# EAGLE design PRE_amp_16_5 (EAGLE 5.06)
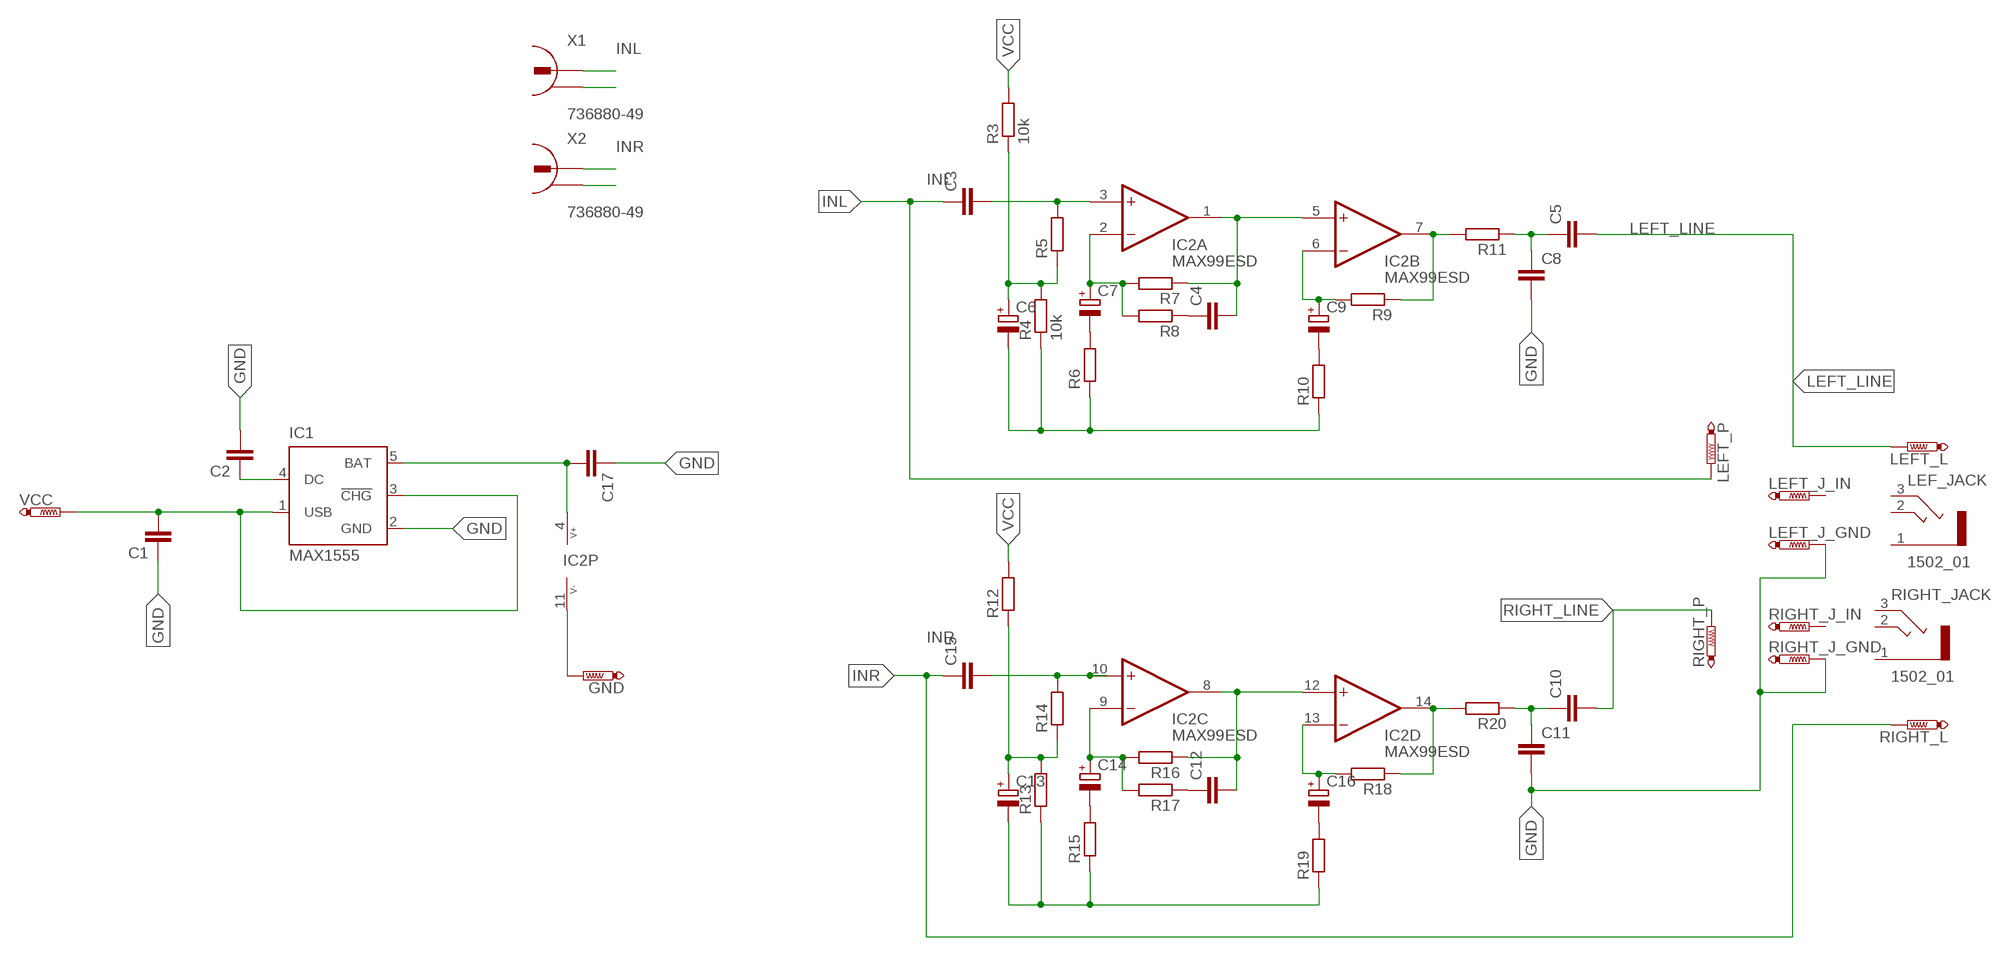
[diagram p0: schematic, sheet 1]

## Parts
C1  C-EU050-025X075  [C050-025X075]
C2  C-EU050-025X075  [C050-025X075]
C3  C-EU050-025X075  [C050-025X075]
C4  C-EU050-025X075  [C050-025X075]
C5  C-EU050-025X075  [C050-025X075]
C6  CPOL-EUB45181B  [B45181B]
C7  CPOL-EUB45181B  [B45181B]
C8  C-EU050-025X075  [C050-025X075]
C9  CPOL-EUB45181B  [B45181B]
C10  C-EU050-025X075  [C050-025X075]
C11  C-EU050-025X075  [C050-025X075]
C12  C-EU050-025X075  [C050-025X075]
C13  CPOL-EUB45181B  [B45181B]
C14  CPOL-EUB45181B  [B45181B]
C15  C-EU050-025X075  [C050-025X075]
C16  CPOL-EUB45181B  [B45181B]
C17  C-EU050-025X075  [C050-025X075]
GND  PTR1PAD1-13Y  [P1-13Y]
IC1  MAX1555  [SOT23-5L]
IC2  MAX99ESD  [SO14]
LEF_JACK  1502_01  [1502_01]
LEFT_J_GND  PTR1PAD1-13Y  [P1-13Y]
LEFT_J_IN  PTR1PAD1-13Y  [P1-13Y]
LEFT_L  PTR1PAD1-13Y  [P1-13Y]
LEFT_P  PTR1PAD1-13Y  [P1-13Y]
R3  10k  R-EU_R5025  [R5025]
R4  10k  R-EU_R5025  [R5025]
R5  R-EU_R5025  [R5025]
R6  R-EU_R5025  [R5025]
R7  R-EU_R5025  [R5025]
R8  R-EU_R5025  [R5025]
R9  R-EU_R5025  [R5025]
R10  R-EU_R5025  [R5025]
R11  R-EU_R5025  [R5025]
R12  R-EU_R5025  [R5025]
R13  R-EU_R5025  [R5025]
R14  R-EU_R5025  [R5025]
R15  R-EU_R5025  [R5025]
R16  R-EU_R5025  [R5025]
R17  R-EU_R5025  [R5025]
R18  R-EU_R5025  [R5025]
R19  R-EU_R5025  [R5025]
R20  R-EU_R5025  [R5025]
RIGHT_J_GND  PTR1PAD1-13Y  [P1-13Y]
RIGHT_J_IN  PTR1PAD1-13Y  [P1-13Y]
RIGHT_JACK  1502_01  [1502_01]
RIGHT_L  PTR1PAD1-13Y  [P1-13Y]
RIGHT_P  PTR1PAD1-13Y  [P1-13Y]
VCC  PTR1PAD1-13Y  [P1-13Y]
X1  736880-49  [736880-49]
X2  736880-49  [736880-49]

## Nets
GND: C1.1 C2.2 C6.- C8.2 C11.2 C13.- C17.1 GND.1(TP) IC1.2(GND) IC2.11(P:V-) LEFT_J_GND.1(TP) R4.1 R6.1 R10.1 R13.1 R15.1 R19.1 RIGHT_J_GND.1(TP) X1.2 X2.2
INL: C3.1 LEFT_P.1(TP) X1.1
INR: C15.1 RIGHT_L.1(TP) X2.1
LEFT_LINE: C5.2 LEFT_L.1(TP)
N$1: C3.2 IC2.3(A:+IN) R5.2
N$2: C6.+ R3.1 R4.2 R5.1
N$3: C15.2 IC2.10(C:+IN) R14.2
N$4: C13.+ R12.1 R13.2 R14.1
N$5: IC2.7(B:OUT) R9.1 R11.2
N$6: C7.- R6.2
N$7: C4.1 R8.1
N$8: C12.1 R17.1
N$9: C7.+ IC2.2(A:-IN) R7.2 R8.2
N$10: C9.- R10.2
N$11: C5.1 C8.1 R11.1
N$12: C14.- R15.2
N$13: C9.+ IC2.6(B:-IN) R9.2
N$14: C1.2 IC1.1(USB) IC1.3(!CHG) VCC.1(TP)
N$15: C12.2 IC2.8(C:OUT) IC2.12(D:+IN) R16.1
N$16: C14.+ IC2.9(C:-IN) R16.2 R17.2
N$17: C16.- R19.2
N$18: IC2.14(D:OUT) R18.1 R20.2
N$19: C4.2 IC2.1(A:OUT) IC2.5(B:+IN) R7.1
N$20: C16.+ IC2.13(D:-IN) R18.2
N$21: C17.2 IC1.5(BAT) IC2.4(P:V+)
N$22: C2.1 IC1.4(DC)
NS2: C10.1 C11.1 R20.1
RIGHT_LINE: C10.2 RIGHT_P.1(TP)
VCC: R3.2 R12.2
Unconnected: LEF_JACK.1 LEF_JACK.2 LEF_JACK.3 LEFT_J_IN.1(TP) RIGHT_J_IN.1(TP) RIGHT_JACK.1 RIGHT_JACK.2 RIGHT_JACK.3 X1.2@2 X2.2@2

## Library data of the parts
C1-C5 C8 C10-C12 C15 C17 = rcl:C-EU: CAPACITOR, European symbol
C6 C7 C9 C13 C14 C16 = rcl:CPOL-EU: POLARIZED CAPACITOR, European symbol
GND LEFT_J_GND LEFT_J_IN LEFT_L LEFT_P RIGHT_J_GND RIGHT_J_IN RIGHT_L RIGHT_P VCC = testpad:PTR1: TEST PIN
IC1 = maxim:MAX1555: Dual-Input USB/AC Adapter 1-Cell Li+ Battery Chargers Source: http://www.maxim-ic.com .. MAX1551-MAX1555.pdf
IC2 = maxim:MAX99*: Micropower, Low-Voltage Rail-to-Rail I/O Comparators Source: http://pdfserv.maxim-ic.com/en/ds/MAX985-MAX994.pdf
LEF_JACK RIGHT_JACK = con-lumberg:1502_01: Jack connectors according to JISC 6560, 3.5 mm Klinkensteckverbinder nach JISC 6560, 3,5 mm Source: http://www.lumberg.com/Produkte/PDFs/1502_01.pdf
R3-R20 = rcl:R-EU_: RESISTOR, European symbol
X1 X2 = con-conrad:736880-49: Cinch Connector ( RCA Jack )

## Board
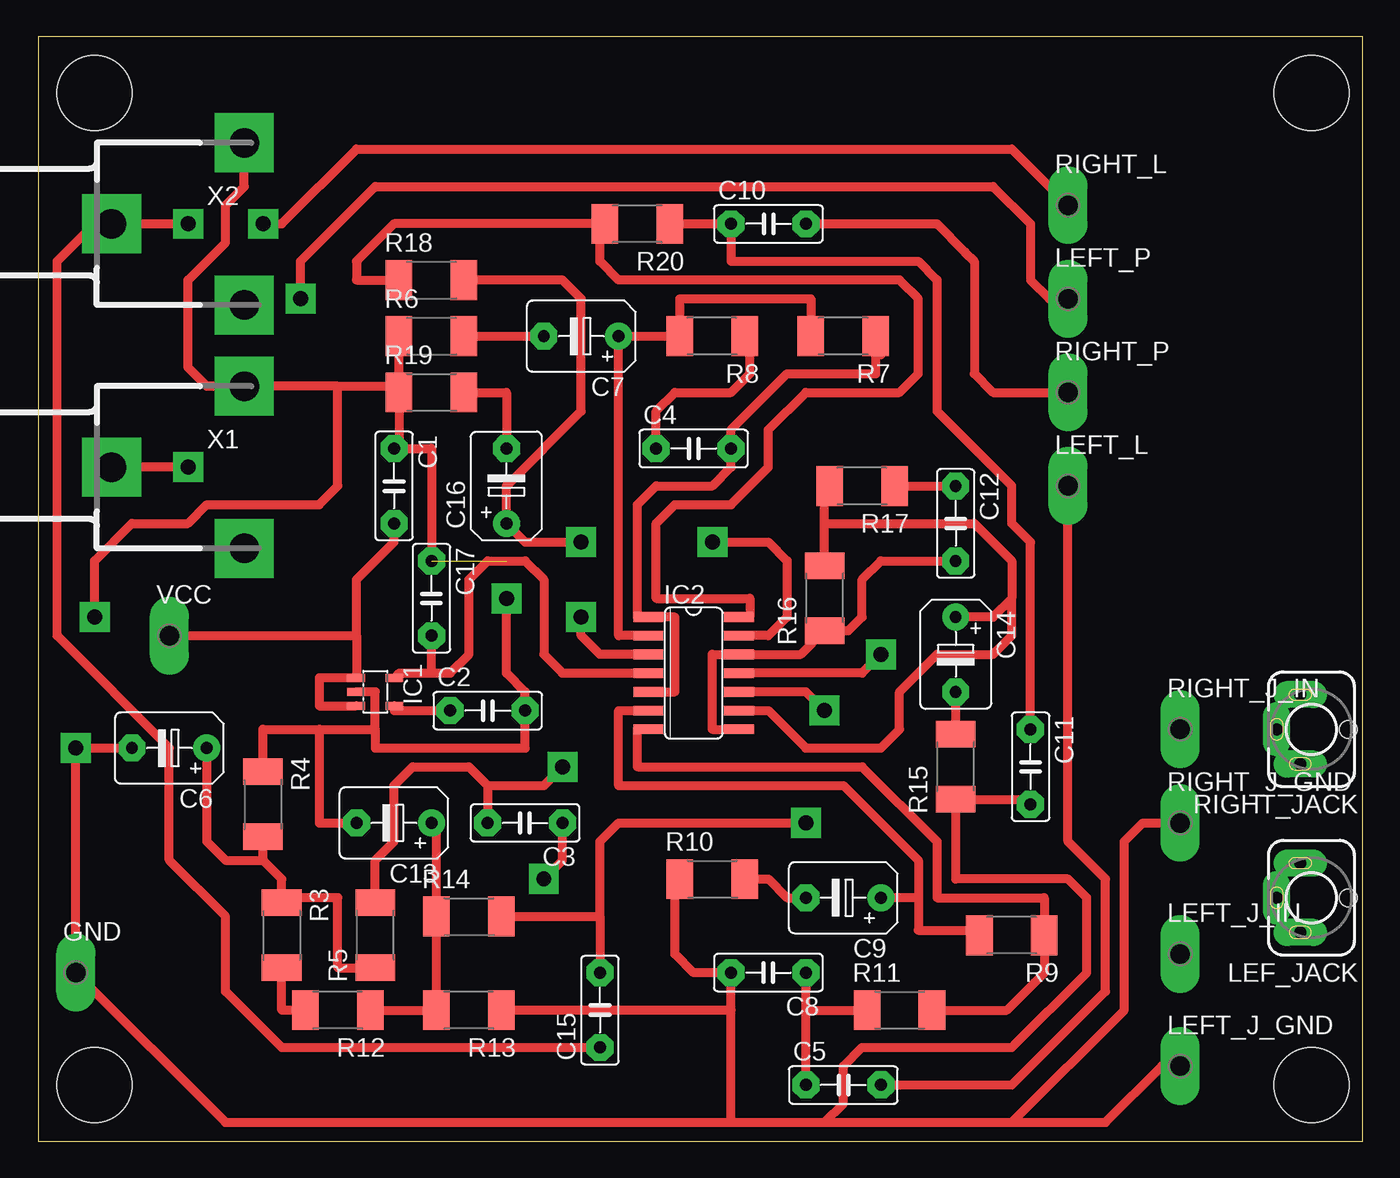
[diagram p1: board, top side]
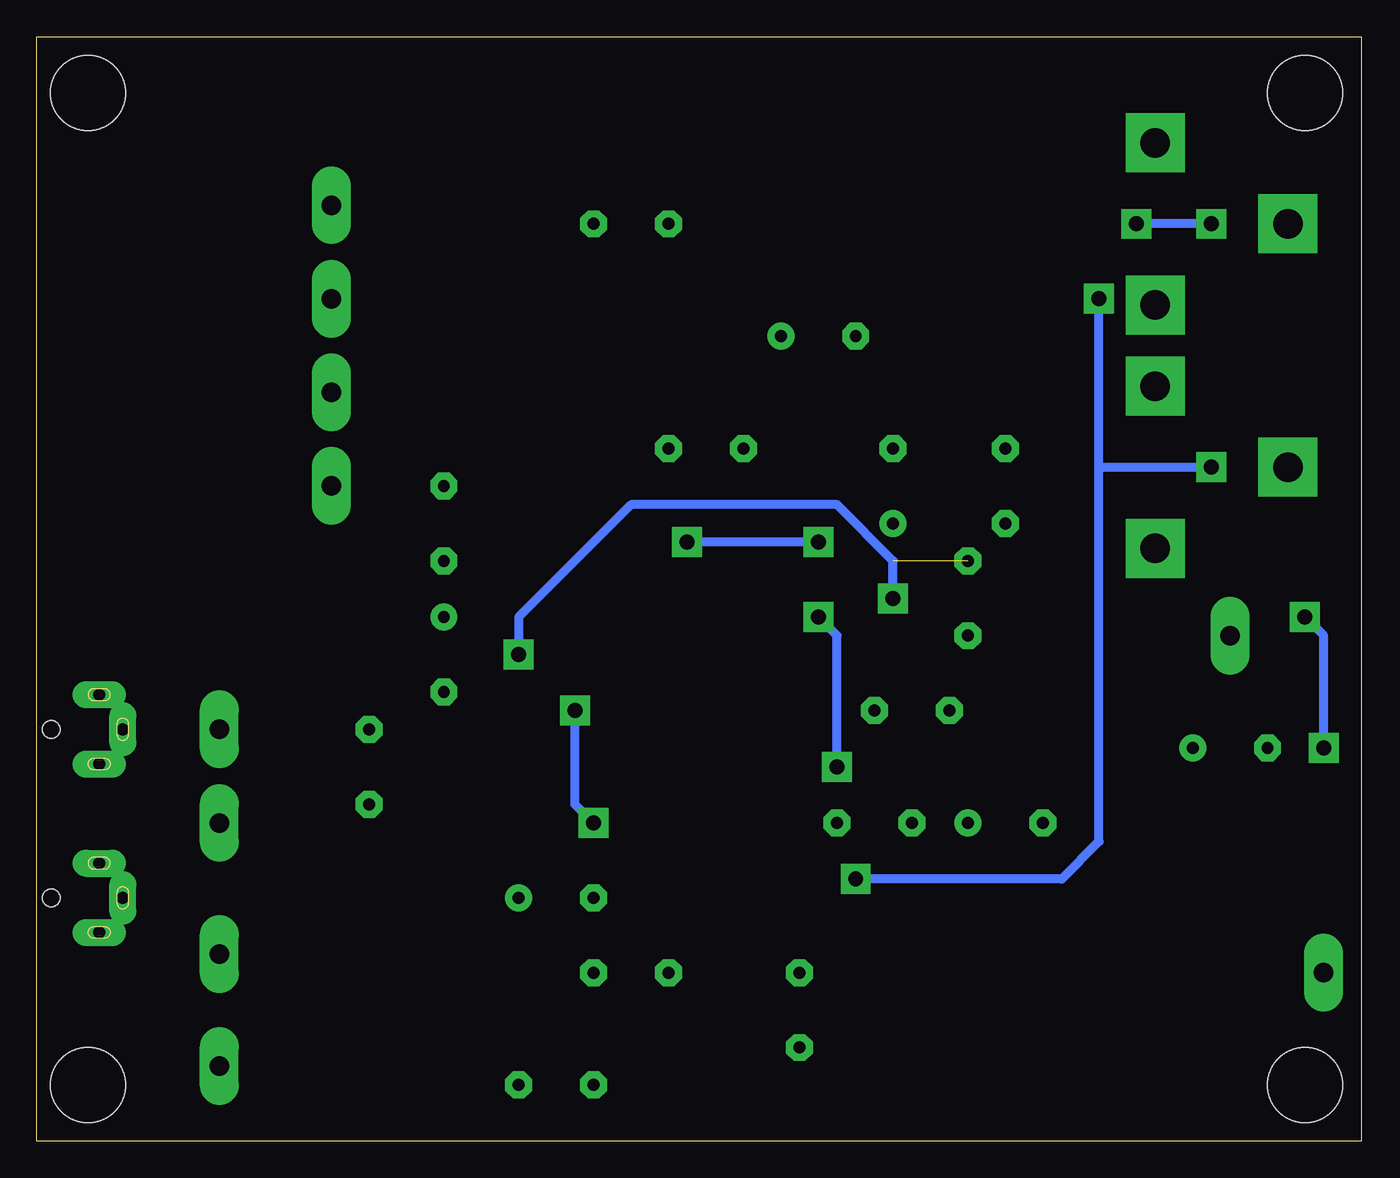
[diagram p2: board, bottom side, seen from below]

Size 89.84 x 74.92 mm. Coordinates in mm from the lower left corner, seen from the top.
Outline: 0,0 89.84,0 89.84,74.92 0,74.92 0,0
Copper layers (1*16): Top 0.035mm / dielectric 1.5mm / Bottom 0.035mm
Design rules "LabE": minimum track width 24mil, minimum drill 0.8mm, track to track 16mil, track to pad 16mil, pad to pad 16mil, via to via 16mil, smd to smd 16mil, copper to edge 0mil, drill to drill 16mil, minimum pad ring 20mil, minimum via ring 20mil, stop-mask expansion 4mil, vias tented up to drill 0mil, thermal gap 10mil
Holes 5.08 mm at 86.36,71.12 3.81,71.12 3.81,3.81 86.36,3.81

### Footprints (pad centres in the part's own frame; a part is rotated, then mirrored left to right if it is on the bottom)
C050-025X075 = drill 0.813 octagon: 1 -2.54,0; 2 2.54,0
B45181B = drill 0.813 round: + -2.54,0 | drill 0.813 octagon: - 2.54,0
P1-13Y = drill 1.321 pad 1.905 long: 1 0,0
SOT23-5L = smd 0.55 x 1.2: 1 -0.95,-1.3; 2 0,-1.3; 3 0.95,-1.3; 4 0.95,1.3; 5 -0.95,1.3
SO14 = smd 0.66 x 2.032: 1 -3.81,-3.073; 2 -2.54,-3.073; 3 -1.27,-3.073; 4 0,-3.073; 5 1.27,-3.073; 6 2.54,-3.073; 7 3.81,-3.073; 8 3.81,3.073; 9 2.54,3.073; 10 1.27,3.073; 11 0,3.073; 12 -1.27,3.073; 13 -2.54,3.073; 14 -3.81,3.073
1502_01 = drill 0.8 pad 1.2 long: 1 0,2.35; 2 -2.35,0.75; 3 2.35,0.75 | hole 1.2: 0,-2.5
R5025 = smd 1.8 x 2.7: 1 -2.2,0; 2 2.2,0
736880-49 = drill 2 pad 3.81 square: 1 -3.92,0; 2 5.08,5.5; 2@2 5.08,-5.5

### Placement (x,y rotation side)
C1  24.13,44.45 270 top
C2  30.48,29.21 0 top
C3  33.02,21.59 180 top
C4  44.45,46.99 0 top
C5  54.61,3.81 0 top
C6  8.89,26.67 180 top
C7  36.83,54.61 180 top
C8  49.53,11.43 180 top
C9  54.61,16.51 180 top
C10  49.53,62.23 0 top
C11  67.31,25.4 270 top
C12  62.23,41.91 270 top
C13  24.13,21.59 180 top
C14  62.23,33.02 270 top
C15  38.1,8.89 90 top
C16  31.75,44.45 90 top
C17  26.67,36.83 270 top
GND  2.54,11.43 0 top
IC1  22.86,30.48 270 top
IC2  44.45,31.75 270 top
LEF_JACK  86.36,16.51 90 top
LEFT_J_GND  77.47,5.08 0 top
LEFT_J_IN  77.47,12.7 0 top
LEFT_L  69.85,44.45 0 top
LEFT_P  69.85,57.15 0 top
R3  16.51,13.97 270 top
R4  15.24,22.86 270 top
R5  22.86,13.97 90 top
R6  26.67,54.61 0 top
R7  54.61,54.61 180 top
R8  45.72,54.61 180 top
R9  66.04,13.97 180 top
R10  45.72,17.78 0 top
R11  58.42,8.89 0 top
R12  20.32,8.89 180 top
R13  29.21,8.89 180 top
R14  29.21,15.24 0 top
R15  62.23,25.4 90 top
R16  53.34,36.83 90 top
R17  55.88,44.45 180 top
R18  26.67,58.42 0 top
R19  26.67,50.8 0 top
R20  40.64,62.23 180 top
RIGHT_J_GND  77.47,21.59 0 top
RIGHT_J_IN  77.47,27.94 0 top
RIGHT_JACK  86.36,27.94 90 top
RIGHT_L  69.85,63.5 0 top
RIGHT_P  69.85,50.8 0 top
VCC  8.89,34.29 0 top
X1  8.89,45.72 0 top
X2  8.89,62.23 0 top

### Tracks (layer width: path | path; a pad name or v marks a point on that pad's centre or on a via)
GND  (via drill 1.02)  (1 unrouted)
  Top 0.61: 11.43,51.22 X1.2 | IC1.2 22.86,30.48 22.86,27.94 | 19.05,27.94 22.86,27.94 | C13.- 19.05,21.59 19.05,27.94 | 22.86,27.94 22.86,26.67 33.02,26.67 C2.2 33.02,30.48 31.75,31.75 v31.75,36.83 | 20.32,51.22 11.43,51.22 | 20.32,51.22 24.05,51.22 R19.1 | R19.1 24.47,47.33 C1.1 26.67,46.99 C17.1 | X2.2 13.97,64.77 12.7,63.5 12.7,60.96 10.16,58.42 10.16,52.49 11.43,51.22 | 20.32,51.22 20.32,44.45 19.05,43.18 11.43,43.18 10.16,41.91 6.35,41.91 3.81,39.37 v3.81,35.56 | R19.1 24.13,50.8 | R19.1 R6.1 | v57.15,33.02 55.88,31.75 IC2.11 | C11.2 66.97,23.2 R15.1 62.23,17.78 69.85,17.78 71.12,16.51 71.12,11.43 66.04,6.35 55.88,6.35 54.61,5.08 54.61,2.54 53.34,1.27 | 46.99,8.89 C8.2 44.45,11.43 43.18,12.7 43.18,17.44 R10.1 | LEFT_J_GND.1 76.2,5.08 72.39,1.27 66.04,1.27 | 53.34,1.27 66.04,1.27 | RIGHT_J_GND.1 74.93,21.59 73.66,20.32 73.66,8.89 66.04,1.27 | 19.05,27.94 15.24,27.94 R4.1 | 46.99,1.27 12.7,1.27 GND.1 v2.54,26.67 C6.- | 46.99,1.27 53.34,1.27 | 46.99,8.89 R13.1 | 46.99,1.27 46.99,8.89
  Bottom 0.61: v31.75,36.83 31.75,39.37 35.56,43.18 49.53,43.18 57.15,35.56 v57.15,33.02 | v2.54,26.67 2.54,34.29 v3.81,35.56
INL  (via drill 1.02)
  Top 0.61: v10.16,45.72 X1.1 | C3.1 35.56,19.05 v34.29,17.78 | v17.78,57.15 17.78,59.69 22.86,64.77 64.77,64.77 67.31,62.23 67.31,58.42 68.58,57.15 LEFT_P.1
  Bottom 0.61: v34.29,17.78 20.32,17.78 17.78,20.32 17.78,45.72 | 17.78,45.72 v10.16,45.72 | 17.78,45.72 v17.78,57.15
INR  (via drill 1.02)
  Top 0.61: v10.16,62.23 X2.1 3.81,62.23 3.17,61.59 | v15.24,62.23 16.51,62.23 21.59,67.31 66.04,67.31 RIGHT_L.1 | 3.17,61.59 2.54,60.96 | 3.17,61.59 1.27,59.69 1.27,34.29 8.89,26.67 8.89,19.05 12.7,15.24 12.7,10.16 16.51,6.35 C15.1
  Bottom 0.61: v10.16,62.23 v15.24,62.23
LEFT_LINE
  Top 0.61: LEFT_L.1 69.85,20.32 72.39,17.78 72.39,10.16 66.04,3.81 C5.2
N$1  (via drill 1.02)
  Top 0.61: R5.2 22.86,19.05 24.13,20.32 24.13,24.13 25.4,25.4 29.21,25.4 30.48,24.13 | 30.48,24.13 C3.2 | 30.48,24.13 34.29,24.13 v35.56,25.4 | IC2.3 38.1,33.02 36.83,34.29 v36.83,35.56
  Bottom 0.61: v35.56,25.4 35.56,34.29 v36.83,35.56
N$2
  Top 0.61: R5.1 20.32,11.77 20.32,16.51 16.51,16.51 R3.1 16.51,17.78 15.24,19.05 | 15.24,19.05 R4.2 | C6.+ 11.43,20.32 12.7,19.05 15.24,19.05
N$3  (via drill 1.02)
  Top 0.61: IC2.10 52.07,30.48 v53.34,29.21 | v52.07,21.59 39.37,21.59 38.1,20.32 38.1,15.24 | R14.2 38.1,15.24 | 38.1,15.24 C15.2
  Bottom 0.61: v53.34,29.21 53.34,22.86 v52.07,21.59
N$4
  Top 0.61: C13.+ 27.01,21.59 R14.1 R13.2 R12.1
N$5
  Top 0.61: R9.1 68.58,14.31 | R9.1 68.24,16.51 60.96,16.51 60.96,20.32 55.88,25.4 40.64,25.4 40.64,27.94 IC2.7 | R9.1 68.24,11.43 65.7,8.89 R11.2
N$6
  Top 0.61: R6.2 C7.-
N$7
  Top 0.61: 48.26,54.27 48.26,53.34 | C4.1 41.91,49.53 43.18,50.8 46.99,50.8 48.26,52.07 48.26,54.27 | 48.26,54.27 R8.1
N$8
  Top 0.61: R17.1 C12.1
N$9
  Top 0.61: IC2.2 39.37,34.29 C7.+ R8.2 43.52,57.15 52.41,57.15 R7.2 52.07,54.95
N$10
  Top 0.61: R10.2 49.53,17.78 50.8,16.51 C9.-
N$11
  Top 0.61: 52.07,10.16 C8.1 52.07,8.89 | C5.1 52.07,8.89 | 52.07,8.89 R11.1
N$12
  Top 0.61: R15.2 C14.-
N$13
  Top 0.61: IC2.6 39.37,29.21 39.37,24.13 54.61,24.13 59.69,19.05 59.69,16.51 | R9.2 63.5,14.31 59.69,14.31 59.69,16.51 | 59.69,16.51 C9.+
N$14
  Top 0.61: IC1.3 19.05,29.53 19.05,31.43 IC1.1 21.59,31.46 21.59,34.29 | C1.2 24.13,40.64 21.59,38.1 21.59,34.29 | VCC.1 21.59,34.29
N$15
  Top 0.61: IC2.8 45.72,27.94 45.72,33.02 IC2.12 51.73,33.02 R16.1 54.95,34.63 55.88,35.56 55.88,38.1 57.15,39.37 C12.2
N$16
  Top 0.61: R16.2 53.34,41.91 | 53.34,41.91 53.34,44.11 R17.2 | C14.+ 64.77,35.56 66.04,36.83 | 66.04,36.83 66.04,34.29 64.77,33.02 60.96,33.02 58.42,30.48 58.42,27.94 57.15,26.67 52.07,26.67 49.53,29.21 IC2.9 | 53.34,41.91 63.5,41.91 66.04,39.37 66.04,36.83
N$17
  Top 0.61: C16.- 31.75,50.8 R19.2
N$18
  Top 0.61: IC2.14 48.26,35.56 48.26,36.83 41.91,36.83 41.91,41.91 43.18,43.18 46.99,43.18 49.53,45.72 49.53,48.26 52.07,50.8 58.42,50.8 59.69,52.07 59.69,57.15 58.42,58.42 39.37,58.42 38.1,59.69 38.1,62.23 R20.2 24.13,62.23 21.59,59.69 21.59,58.42 R18.1
N$19
  Top 0.61: IC2.5 43.18,30.48 43.18,35.56 IC2.1 40.64,35.56 40.64,43.18 41.91,44.45 45.72,44.45 46.99,45.72 C4.2 46.99,48.26 50.8,52.07 56.81,52.07 R7.1 57.15,54.27 57.15,53.34
N$20  (via drill 1.02)
  Top 0.61: IC2.13 49.53,34.29 50.8,35.56 50.8,39.37 49.53,40.64 v45.72,40.64 | v36.83,40.64 33.02,40.64 C16.+ 31.75,44.45 36.83,49.53 36.83,57.15 35.56,58.42 R18.2
  Bottom 0.61: v36.83,40.64 v45.72,40.64
N$21
  Top 0.61: 26.67,31.75 24.48,31.75 IC1.5 | 26.67,31.75 C17.2 | 26.67,31.75 27.94,31.75 29.21,33.02 29.21,38.1 30.48,39.37 33.02,39.37 34.29,38.1 34.29,33.02 35.56,31.75 IC2.4
N$22
  Top 0.61: C2.1 24.16,29.21 IC1.4
NS2
  Top 0.61: R20.1 C10.1 46.99,59.69 59.69,59.69 60.96,58.42 60.96,49.53 66.04,44.45 66.04,41.91 67.31,40.64 C11.1
RIGHT_LINE
  Top 0.61: C10.2 60.96,62.23 62.87,60.33 63.5,59.69 63.5,52.07 64.77,50.8 RIGHT_P.1
VCC
  Top 0.61: R12.2 16.51,8.89 R3.2